# Altium schematic sheet UnRegPower.SchDoc
size 420 x 297 mm; SheetNumber: 8; SheetTotal: 21
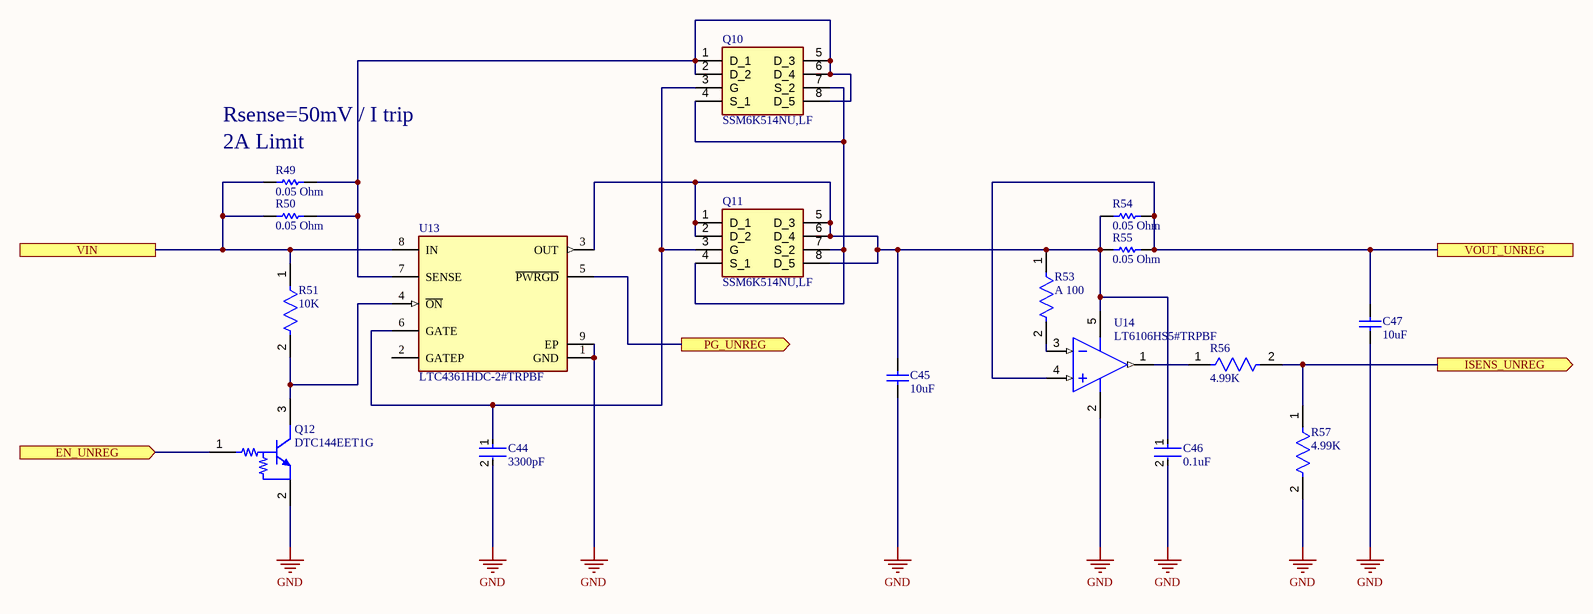
[diagram p0: UnRegPower.SchDoc]

## Parts
C44  3300pF  [FP-C0603C-CF-MFG]
C45  10uF  [CAPC2013X140X45NL15T25]
C46  0.1uF  [FP-C0603C-CF-MFG]
C47  10uF  [CAPC2013X140X45NL15T25]
Q10  SSM6K514NU,LF  [UDFN6B]
Q11  SSM6K514NU,LF  [UDFN6B]
Q12  DTC144EET1G  [ONSC-SC-75-3-463-01_V]
R49  0.05 Ohm  [RESC1608X55X30NL15T15]
R50  0.05 Ohm  [RESC1608X55X30NL15T15]
R51  10K  [FP-RK73B1J-MFG]
R53  A 100  [FP-ERA3A-IPC_B]
R54  0.05 Ohm  [RESC1608X55X30NL15T15]
R55  0.05 Ohm  [RESC1608X55X30NL15T15]
R56  4.99K  [FP-ERA3A-IPC_C]
R57  4.99K  [FP-ERA3A-IPC_C]
U13  LTC4361HDC-2#TRPBF  [FP-DC8-8-05-08-1719-IPC_C]
U14  LT6106HS5#TRPBF  [LT-S5-5-TSOT-23_M]

## Ports
EN_UNREG (in), ISENS_UNREG (out), PG_UNREG (out), VIN, VOUT_UNREG

## Nets
GND: C44.2 C45.1 C46.2 C47.1 Q12.2(E) R57.2 U13.1(GND) U13.9(EP) U14.2(V-)
EN_UNREG: Q12.1(B) ; port EN_UNREG
ISENS_UNREG: R56.2 R57.1 ; port ISENS_UNREG
PG_UNREG: U13.5(~{PWRGD}) ; port PG_UNREG
VIN: R49.1 R50.1 R51.1 U13.8(IN) ; port VIN
VOUT_UNREG: C47.2 R54.2 R55.2 U14.4(+IN) ; port VOUT_UNREG
NetC44_1: C44.1 Q10.3(G) Q11.3(G) U13.6(GATE)
NetC45_2: C45.2 C46.1 Q11.1(D_1) Q11.2(D_2) Q11.5(D_3) Q11.6(D_4) Q11.8(D_5) R53.1 R54.1 R55.1 U13.3(OUT) U14.5(V+)
NetQ10_1: Q10.1(D_1) Q10.2(D_2) Q10.5(D_3) Q10.6(D_4) Q10.8(D_5) R49.2 R50.2 U13.7(SENSE)
NetQ10_4: Q10.4(S_1) Q10.7(S_2) Q11.4(S_1) Q11.7(S_2)
NetQ12_3: Q12.3(C) R51.2 U13.4(~{ON})
NetR53_2: R53.2 U14.3(-IN)
NetR56_1: R56.1 U14.1(OUT)

Not connected (* = marked no-connect by the designer): U13 2(GATEP)

## Notes on the sheet
- Rsense=50mV / I trip
- (near R49) 2A Limit
- THIS DOCUMENT AND THE DATA DISCLOSED HEREIN OR
- HEREWITH IS THE PROPERTY OF ALTIUM LIMITED AND MAY
- DWG NO:
- REVISION
- REV:
- DESCRIPTION
- DATE
- APPROVED
- BE FREELY DISTRIBUTED IN WHOLE. NO RIGHTS ARE
- RESERVED OR EXPRESS OR IMPLIED WARANTEE GIVEN.
- ENG:
- APPROVALS
- PROJECT
- DSN:
- CHK:
- REFERENCE DOCUMENTS
- PROJECT REVISION:
- TITLE
- DOCUMENT REVISION:
- DESIGN ITEM:
- BOM:
- FAB DWG:
- PCB DWG:
- ASSY DWG:
- SCALE:
- A3
- SIZE
- CAGE CODE
- FILE NAME
- DWG NO.
- SHEET
- OF
- REV

## Library data of the parts
C44 = CMP-2006-03174-2: CAP CER 3300PF 50V 5% X7R 0603; Manufacturer Part Number: C0603C332J5RACTU; Manufacturer: KEMET; Automotive Grade: Grade 1; Material: Ceramic; Value: 3,300 pF; Temperature Coefficient: 30ppm/°C; Tolerance: 0.05; Temperature Range Low: -55°C; Device Class L3: Ceramic Capacitors; Temperature Characteristic: X7R; Temperature: -55°C to +125°C; Device Class L1: Passive Components; ComponentLink2URL: https://api.kemet.com/component-edge/download/datasheet/C0603C100J5GACAUTO.pdf; Automotive: Yes; Capacitance: 3,300 pF; RoHS: TRUE; Mouser Description: Multilayer Ceramic Capacitors MLCC - SMD/SMT 50volts 3300pF X7R 5%; Height: 0.87mm; Temperature Range High: +125°C; ComponentLink2Description: Datasheet; Voltage Rating: 50 V; Octopart: https://octopart.com/c0603c332j5ractu-kemet-9139905; Package: C0603C-CF; Lead Free: Yes; Device Class L2: Capacitors; Digikey Description: CAP CER 3300PF 50V 5% X7R 0603; Category: Cap
C45 C47 = CMP-2007-03395-1: Part Number: GRM21BR71A106KE51L; Manufacturer: Murata
C46 = CMP-2006-03061-2: CAP CER 0.1UF 50V X7R 0603; Manufacturer: KEMET; Manufacturer Part Number: C0603C104K5RACTU; Tolerance: 0.1; Temperature Coefficient: 30ppm/°C; Material: Ceramic; Automotive Grade: Grade 1; Value: 0.10 μF; Temperature: -55°C to +125°C; RoHS: TRUE; Temperature Range High: +125°C; Lead Free: Yes; Octopart: https://octopart.com/c0603c104k5ractu-kemet-139244; Digikey Description: CAP CER 0.1UF 50V X7R 0603; Category: Cap; Package: C0603C-CF; ComponentLink2Description: Datasheet; Temperature Range Low: -55°C; Device Class L1: Passive Components; Voltage Rating: 50 V; Automotive: Yes; Device Class L3: Ceramic Capacitors; ComponentLink2URL: https://api.kemet.com/component-edge/download/datasheet/C0603C100J5GACAUTO.pdf; Capacitance: 0.10 μF; Device Class L2: Capacitors; Temperature Characteristic: X7R; Height: 0.87mm
Q10 Q11 = SSM6K514NU,LF: MOSFET (N-Channel); Manufacturer_Name: Toshiba; Datasheet Link: http://toshiba.semicon-storage.com/info/docget.jsp?did=29875&prodName=SSM6N7002CFU; Manufacturer_Part_Number: SSM6K514NU,LF; Mouser Part Number: 757-SSM6K514NULF; Mouser Price/Stock: https://www.mouser.co.uk/ProductDetail/Toshiba/SSM6K514NULF?qs=yfGysFjEcj13lHFOvblArQ%3D%3D; Arrow Part Number: SSM6K514NU,LF; Arrow Price/Stock: https://www.arrow.com/en/products/ssm6k514nulf/toshiba?region=nac
Q12 = CMP-0630-00198-1: Digital Transistor (BRT), R1=47 kOhm, R2=47 kOhm, NPN Transistor, 3-Pin SC-75, Pb-Free, Tape and Reel; Manufacturer: On Semiconductor; hFE Min: 80; R1/R2 Typ: 1; IC Continuous (A): 0.1; V(BR)CEO Min (V): 50; Mounting Technology: Surface Mount; PartNumber: DTC144EET1G; Polarity: NPN; PackageReference: SC-75-3-463-01; ComponentLink2URL: http://www.onsemi.cn/pub_link/Collateral/DTC144E-D.PDF; PackageVersion: Rev. F, 07/2005; ComponentLink3Description: Package Specification; ComponentLink1Description: Manufacturer URL; ComponentLink1URL: http://www.onsemi.com/; DatasheetVersion: Rev. 2; Packing: Tape and Reel; PackageDescription: 3-Pin Small Outline Transistor, Body 1.6 x 0.8 mm, Pitch 0.5 mm; ComponentLink2Description: Datasheet; RoHS: TRUE; ComponentLink3URL: http://www.onsemi.com/pub_link/Collateral/463-01.PDF
R49 R50 R54 R55 = CMP-2000-00867-1: Manufacturer: Panasonic; Part Number: ERJ-L03KF50MV
R51 = CMP-2000-01851-2: RES 10K OHM 5% 1/10W 0603; Temperature Coefficient: 200ppm/°C; Voltage Rating: 50V; Power Rating: 100mW; Resistance: 10kR; Length: 1.6mm; Lead Free: Lead Free; Resistance Tolerance: 5%; Case Code (Metric): 1608; Width: 0.8mm; Height: 0.45mm; Max Operating Temperature: 155°C; RoHS Compliant: Yes; Resistor Type: Thick Film; Min Operating Temperature: -55°C; Case Code (Imperial): 0603; Technology: THICK FILM; Package Quantity: 5000; Tolerance: 5%; Case/Package: 0603; Voltage Rating (DC): 50V; Depth: 0.8mm; Packaging: Tape and Reel; Number of Pins: 2; Construction: Rectangular; Series: RK73B; Military Standard: Not; Termination: SMD/SMT
R53 = CMP-2000-00870-2: RES SMD 100 OHM 0.1% 1/10W 0603; Voltage Rating: 75V; Power Rating: 100mW; Resistance: 100R; Temperature Coefficient: 25ppm/°C; Number of Terminations: 2; Case/Package: 0603; Termination: SMD/SMT; Number of Pins: 2; Size Code: 0603; Length: 1.6mm; Min Operating Temperature: -55°C; Resistor Type: Thin Film; Depth: 0.8mm; Military Standard: Not; Packaging: Tape and Reel; RoHS Compliant: Yes; Construction: Rectangular; Resistance Tolerance: 0.1%; Contact Plating: Tin; Width: 0.8mm; Mount: Surface Mount; Case Code (Metric): 1608; Max Operating Temperature: 155°C; Height: 0.45mm; Case Code (Imperial): 0603; Series: ERA-3A; Package Quantity: 5000; REACH SVHC: No SVHC; Tolerance: 0.1%; Max Power Dissipation: 100mW; Radiation Hardening: No; Technology: METAL FILM
R56 R57 = CMP-2000-00077-5: RES SMD 4.99KOHM 0.1% 1/10W 0603; Voltage Rating (DC): 75V; Max Power Dissipation: 100mW; Temperature Coefficient: 25ppm/°C; Resistance: 4.99kR; Voltage Rating: 150V; Features: Automotive AEC-Q200; Depth: 0.8mm; Case Code (Imperial): 0603; Resistance Tolerance: 0.1%; Mount: Surface Mount; Contact Plating: Tin; Length: 1.6mm; RoHS Compliant: Yes; Termination: SMD/SMT; Width: 0.8mm; Case/Package: 0603; Series: ERA; Radiation Hardening: No; Tolerance: 0.1%; Lead Free: Lead Free; Technology: METAL FILM; Construction: Rectangular; Number of Terminations: 2; Weight: 7.1E-05oz; Power Rating: 100mW; Number of Pins: 2; Min Operating Temperature: -55°C; Height: 0.45mm; Case Code (Metric): 1608; Package Quantity: 5000; Military Standard: Not; Max Operating Temperature: 155°C; Resistor Type: Thin Film; Reach SVHC Compliant: Yes; Packaging: Tape and Reel
U13 = CMP-0474-00015-2: IC OVP/OCP PROTECTION CTLR 8DFN; Number of Circuits: 1; RoHS Compliant: Yes; Packaging: Tape and Reel; Case/Package: DFN; Number of Pins: 8; Package Quantity: 2500
U14 = CMP-0359-01984-2: Single Channel, Low Cost, High Side Current Sense Operational Amplifier, 0.2 MHz Typical GBW, 5-Pin SOT-23 (S5-5), High Temperature / Automotive, Pb-Free, Reel; Manufacturer: Linear Technology; Linear Technology Part Number: LT6106; Vos (mV) Typical: 0.15; Vs Min (V): 2.7; Vs Max (V): 36; Is (mA) Typical: 0.06; Vos (mV) Guaranteed: 0.25; Channels (#): 1; GBW (MHz) Typical: 0.2; PackageDescription: 5-Lead Plastic TSOT-23, Body 1.63 x 2.90 mm, Pitch 0.95 mm; ComponentLink3Description: Package Specification; Mounting Technology: Surface Mount; Type: CSA; RevisionNote: URLs updated; ComponentLink2URL: http://cds.linear.com/docs/en/datasheet/6106fa.pdf; ComponentLink1URL: http://www.linear.com/; Code_JEDEC: MO-193; PartNumber: LT6106HS5#TRPBF; Packing: Reel; DatasheetVersion: Rev. A; RoHS: Pb-Free; ComponentLink3URL: http://cds.linear.com/docs/en/packaging/SOT_5_05-08-1635.pdf; ComponentLink1Description: Manufacturer URL; PackageReference: LT-S5-5-TSOT-23; ComponentLink2Description: Datasheet